# Altium schematic sheet interfaces.SchDoc
size A4
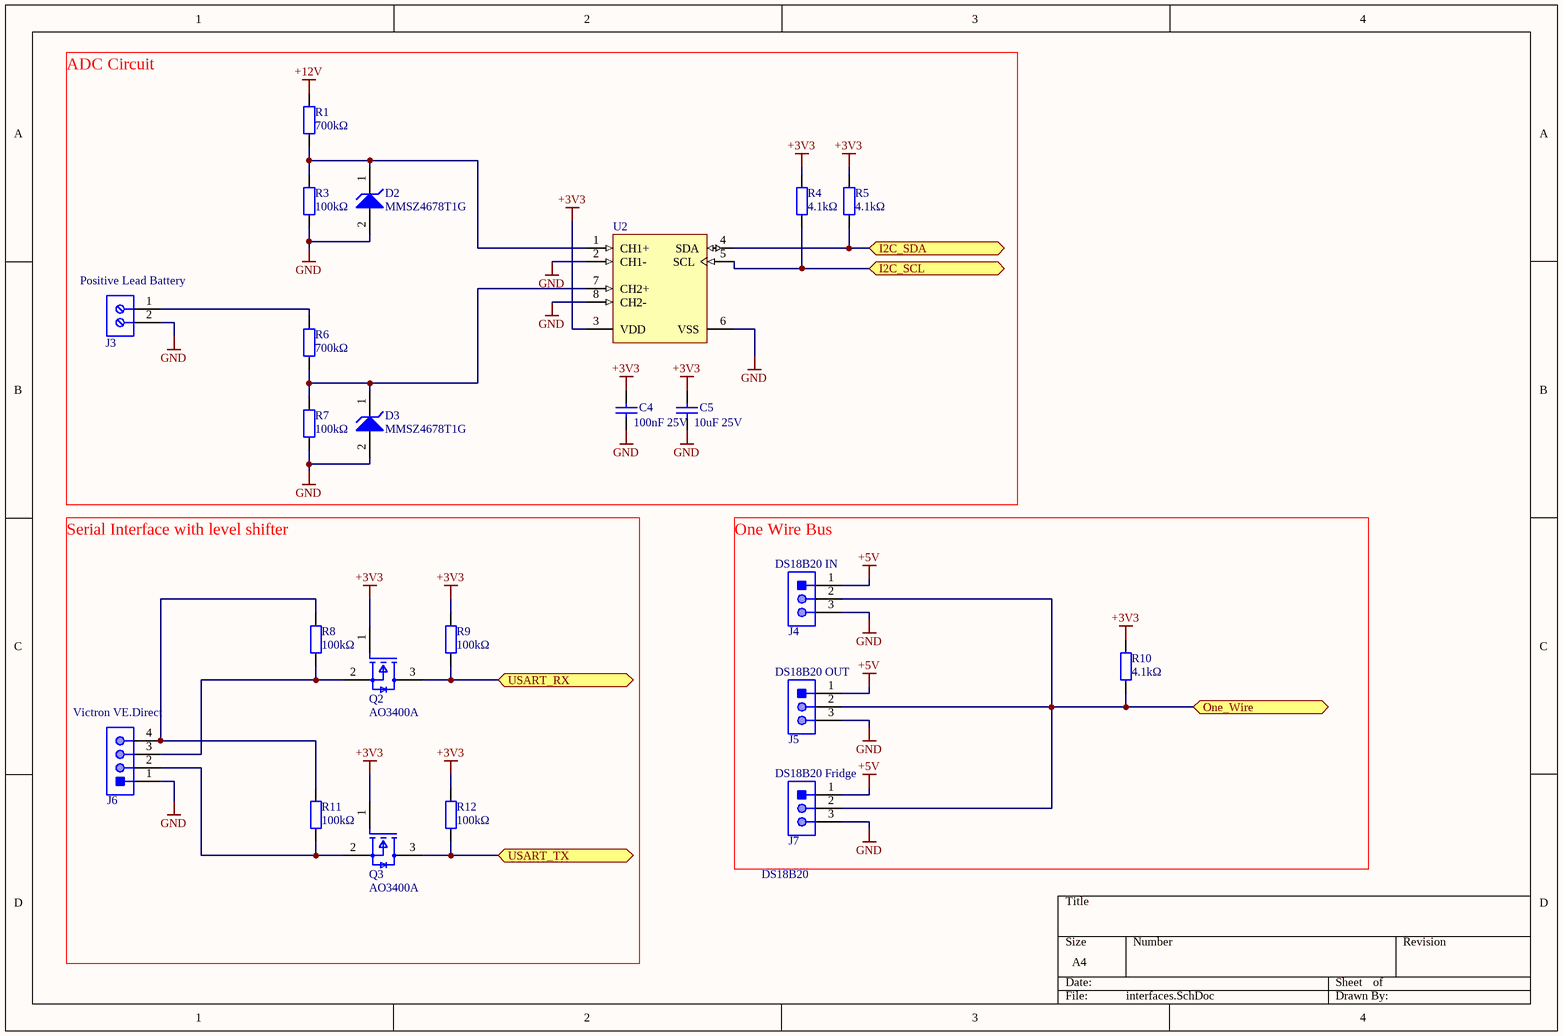
[diagram p0: interfaces.SchDoc]

## Parts
C4  100nF 25V  [CAPC2013X88X50ML20T25]
C5  10uF 25V  [CAPC2013X88X50ML20T25]
D2  MMSZ4678T1G  [ONSC-SOD-123-2-425-04_V]
D3  MMSZ4678T1G  [ONSC-SOD-123-2-425-04_V]
J3  282836-2  [TECO-282836-2_V]  (value not drawn)
J4  JST-S3B-PH-SM4-TB-3_V  [JST-S3B-PH-SM4-TB-3_V]  (value not drawn)
J5  JST-S3B-PH-SM4-TB-3_V  [JST-S3B-PH-SM4-TB-3_V]  (value not drawn)
J6  JST-S4B-PH-SM4-TB-3_V  [JST-S4B-PH-SM4-TB-3_V]  (value not drawn)
J7  JST-S3B-PH-SM4-TB-3_V  [JST-S3B-PH-SM4-TB-3_V]  (value not drawn)
Q2  AO3400A  [SOT-23]
Q3  AO3400A  [SOT-23]
R1  700kΩ  [RESC2013X50X30ML20T20]
R3  100kΩ  [RESC2013X50X30ML20T20]
R4  4.1kΩ  [RESC2013X50X30ML20T20]
R5  4.1kΩ  [RESC2013X50X30ML20T20]
R6  700kΩ  [RESC2013X50X30ML20T20]
R7  100kΩ  [RESC2013X50X30ML20T20]
R8  100kΩ  [RESC2013X50X30ML20T20]
R9  100kΩ  [RESC2013X50X30ML20T20]
R10  4.1kΩ  [RESC2013X50X30ML20T20]
R11  100kΩ  [RESC2013X50X30ML20T20]
R12  100kΩ  [RESC2013X50X30ML20T20]
U2  (no value)  [SOIC-SN8_L]

## Ports
I2C_SCL (bidir), I2C_SDA (bidir), One_Wire (bidir), USART_RX (bidir), USART_TX (bidir)

## Nets
+3V3: C4.2 C5.2 Q2.1(G) Q3.1(G) R4.2 R5.2 R9.1 R10.2 R12.1 U2.3(VDD)
+5V: J4.1 J5.1 J7.1
+12V: R1.1
GND: C4.1 C5.1 D2.2(A) D3.2(A) J3.2 J4.3 J5.3 J6.1 J7.3 R3.1 R7.1 U2.2(CH1-) U2.6(VSS) U2.8(CH2-)
I2C_SCL: R4.1 U2.5(SCL) ; port I2C_SCL
I2C_SDA: R5.1 U2.4(SDA) ; port I2C_SDA
One_Wire: J4.2 J5.2 J7.2 R10.1 ; port One_Wire
USART_RX: Q2.3(D) R9.2 ; port USART_RX
USART_TX: Q3.3(D) R12.2 ; port USART_TX
NetD2_1: D2.1(K) R1.2 R3.2 U2.1(CH1+)
NetD3_1: D3.1(K) R6.2 R7.2 U2.7(CH2+)
NetJ3_1: J3.1 R6.1
NetJ6_2: J6.2 Q3.2(S) R11.2
NetJ6_3: J6.3 Q2.2(S) R8.2
NetJ6_4: J6.4 R8.1 R11.1

## Notes on the sheet
- (near J3) Positive Lead Battery
- ADC Circuit
- (near J4) DS18B20 IN
- (near J6) Victron VE.Direct
- (near J5) DS18B20 OUT
- (near J7) DS18B20 Fridge
- One Wire Bus
- (near J7) DS18B20
- Serial Interface with level shifter

## Library data of the parts
C4 C5 = Cap_0805: Capacitor
D2 D3 = CMP-1060-00511-1: Zener Voltage Regulator, 500 mW, 2-Pin SOD-123, Pb-Free, Tape and Reel; Manufacturer: On Semiconductor; P Max (W): 0.5; VZ Typ (V): 1.8; PackageDescription: 2-Pin SOD, Body 1.6 x 2.69 mm; ComponentLink3Description: Package Specification; PackageReference: SOD-123-2-425-04; RoHS: Pb-Free; PackageVersion: Rev. G, 10/2009; Packing: Tape and Reel; ComponentLink1URL: http://www.onsemi.com/; ComponentLink2Description: Datasheet; ComponentLink3URL: http://www.onsemi.com/pub_link/Collateral/425-04.PDF; ComponentLink2URL: http://www.onsemi.com/pub_link/Collateral/MMSZ4678T1-D.PDF; DatasheetVersion: Rev. 9; ComponentLink1Description: Manufacturer URL; Mounting Technology: Surface Mount; PartNumber: MMSZ4678T1G
J3 = CMP-1684-00017-1: Female Header, Pitch 5 mm, 1 x 2 Position, Height 10 mm, Tail Length 3.5 mm, Rohs, Bulk; Manufacturer: TE Connectivity; Wire Gauge: 16-30AWG; Product Training Modules: Wire-to-BoardEurostyleTerminalBlocks; Clamp Material - Plating: Brass-NickelPlated; Voltage: 300V; Mating Orientation: HorizontalwithBoard; Current: 13.5A; Pitch: 0.197"(5.00mm); Screw Thread: M3; 3D Model: 282836-2.pdf; Other Names: 5ULV-02B / A98076; Dynamic Catalog: BuchananSeries; Number of Levels: 1; Torque - Screw: 0.68Nm(6Lb-In); Featured Product: EurostyleTerminalBlockConnectors; Positions Per Level: 2; Wire Termination: Screw-RisingCageClamp; Datasheet URL: http://www.te.com.cn/commerce/DocumentDelivery/DDEController?Action=showdoc&DocId=Catalog+Section%7F1308389_EUROSTYLE_TERMINAL_BLOCKS%7F0607%7Fpdf%7FEnglish%7FENG_CS_1308389_EUROSTYLE_TERMINAL_BLOCKS_0607.pdf%7F282836-2; Color: Green; Family: TerminalBlocks-WiretoBoard; RoHS Information: 282836-2StatementofCompliance; Standard Package: 300; Contact Material - Plating: Brass-TinPlated; Manufacturer URL: http://www.te.com; Housing Material: Polyamide(PA66),Nylon6/6; Features: Interlocking(Side); Package Description: Female Header, Pitch 5 mm, 1 x 2 Position, Height 10 mm, Tail Length 3.5 mm; Mounting Type: ThroughHole; Package Reference: THD; Packaging: Bulk; Series: Buchanan; Category: Connectors,Interconnects; Screw Material - Plating: Brass-NickelPlated
J4 J5 J7 = CONNECTOR_JST-S3B-PH-SM4
J6 = CONNECTOR_JST-S4B-PH-SM4
Q2 Q3 = MOSFET_AO3400A: MOSFET N-CH 30V 5.7A SOT23; Input Capacitance: 630pF; Number of Elements: 1; Rds On Max: 26.5mR; Max Power Dissipation: 1.4W; Gate to Source Voltage (Vgs): 12V; Min Operating Temperature: -55°C; Lead Free: Lead Free; Number of Pins: 3; Drain to Source Voltage (Vdss): 30V; Case/Package: SOT-23; Mount: Surface Mount; Continuous Drain Current (ID): 5.7A; Radiation Hardening: No; Packaging: Tape and Reel; Max Operating Temperature: 150°C; Power Dissipation: 1.4W
R1 R3-R12 = Res_0805: Resistor
U2 = CMP-0188-01151-1: 16-Bit, Multi-Channel Delta-Sigma Analog-to-Digital Converter with I2C Interface and On-Board Reference, 8-Pin SOIC 150mil, Extended Temperature; ComponentLink2Description: Datasheet; ComponentLink3Description: Package Specification; PackageVersion: revBB, Aug-2009; Code_JEDEC: MS-012; Code_IPC: SOIC127P600-8; PackageDescription: 8-Lead Plastic Small Outline (SN) - Narrow, 3.90mm Body [SOIC]; ComponentLink1Description: Manufacturer URL; ComponentLink2URL: http://ww1.microchip.com/downloads/en/DeviceDoc/22226a.pdf; ComponentLink1URL: http://www.microchip.com/; DatasheetVersion: revA, Dec-2009; ComponentLink3URL: http://www.microchip.com/stellent/groups/techpub_sg/documents/packagingspec/en012702.pdf; PackageReference: SOIC-SN8